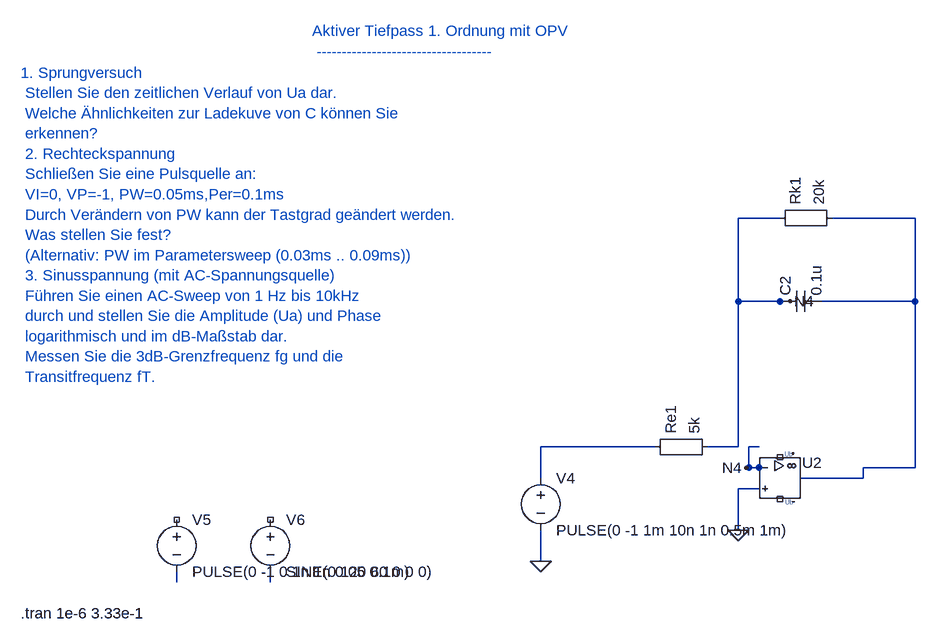
[diagram p0: schematic 7_2_1_Aktiver_Tiefpass.asc]
7_2_1_Aktiver_Tiefpass.asc, the LTspice schematic file:
Version 4
SHEET 1 880 680
WIRE 1296 496 1312 496
WIRE 1200 752 1184 752
WIRE 1184 752 1184 720
WIRE 1184 720 1200 720
WIRE 1264 768 1360 768
WIRE 1360 768 1360 752
WIRE 864 848 864 864
WIRE 304 912 304 928
WIRE 448 912 448 928
WIRE 1232 496 1168 496
WIRE 1168 720 1120 720
WIRE 1200 784 1168 784
WIRE 1168 784 1168 848
WIRE 1360 752 1440 752
WIRE 1440 752 1440 496
WIRE 1168 496 1168 720
WIRE 1232 368 1168 368
WIRE 1168 368 1168 496
WIRE 1440 496 1312 496
WIRE 1312 368 1440 368
WIRE 1440 368 1440 496
WIRE 864 896 864 864
WIRE 864 768 864 720
WIRE 864 720 1040 720
WIRE 1232 496 1248 496
WIRE 1200 752 1180 752
FLAG 1168 848 0
FLAG 864 896 0
FLAG 1168 848 0
FLAG 864 896 0
FLAG 1248 496 N4
FLAG 1180 752 N4
SYMBOL Misc\EuropeanResistor 1024 736 R270
SYMATTR InstName Re1
SYMATTR Value 5k
SYMBOL cap 1232 512 R270
SYMATTR InstName C2
SYMATTR Value 0.1u
SYMBOL UniversalOpAmp2 1232 768 R0
SYMATTR InstName U2
SYMATTR Value UniversalOpAmp2
SYMBOL Misc\EuropeanResistor 1216 384 R270
SYMATTR InstName Rk1
SYMATTR Value 20k
SYMBOL voltage 864 752 R0
SYMATTR InstName V4
SYMATTR Value PULSE(0 -1 1m 10n 1n 0.5m 1m)
SYMBOL voltage 304 816 R0
SYMATTR InstName V5
SYMATTR Value PULSE(0 -1 0 1n 1n 0.05 0.1m)
SYMBOL voltage 448 816 R0
SYMATTR InstName V6
SYMATTR Value SINE(0 120 60 0 0 0)
TEXT 64 976 Left 2 !.tran 1e-6 3.33e-1
TEXT 512 80 Left 2 ;Aktiver Tiefpass 1. Ordnung mit OPV \n -----------------------------------
TEXT 64 144 Left 2 ;1. Sprungversuch \n Stellen Sie den zeitlichen Verlauf von Ua dar. \n Welche Ähnlichkeiten zur Ladekuve von C können Sie \n erkennen? \n 2. Rechteckspannung \n Schließen Sie eine Pulsquelle an: \n VI=0, VP=-1, PW=0.05ms,Per=0.1ms \n Durch Verändern von PW kann der Tastgrad geändert werden. \n Was stellen Sie fest? \n (Alternativ: PW im Parametersweep (0.03ms .. 0.09ms)) \n 3. Sinusspannung (mit AC-Spannungsquelle) \n Führen Sie einen AC-Sweep von 1 Hz bis 10kHz \n durch und stellen Sie die Amplitude (Ua) und Phase \n logarithmisch und im dB-Maßstab dar. \n Messen Sie die 3dB-Grenzfrequenz fg und die \n Transitfrequenz fT.

The netlist it stands for:
* 7_2_1_Aktiver_Tiefpass.asc
Re1 N004 N4 5k
C2 N4 N001 0.1u
XU2 0 N4 NC_01 NC_02 N001 level2 UniversalOpAmp2 Avol=1Meg GBW=10Meg Slew=10Meg Ilimit=25m Rail=0 Vos=0 En=0 Enk=0 In=0 Ink=0 Rin=500Meg  ; pins In+ In- V+ V- OUT
Rk1 N4 N001 20k
V4 N004 0 PULSE(0 -1 1m 10n 1n 0.5m 1m)
V5 NC_03 N002 PULSE(0 -1 0 1n 1n 0.05 0.1m)
V6 NC_04 N003 SINE(0 120 60 0 0 0)
.tran 1e-6 3.33e-1
* Aktiver Tiefpass 1. Ordnung mit OPV
*  -----------------------------------
* 1. Sprungversuch
*  Stellen Sie den zeitlichen Verlauf von Ua dar.
*  Welche Ähnlichkeiten zur Ladekuve von C können Sie
*  erkennen?
*  2. Rechteckspannung
*  Schließen Sie eine Pulsquelle an:
*  VI=0, VP=-1, PW=0.05ms,Per=0.1ms
*  Durch Verändern von PW kann der Tastgrad geändert werden.
*  Was stellen Sie fest?
*  (Alternativ: PW im Parametersweep (0.03ms .. 0.09ms))
*  3. Sinusspannung (mit AC-Spannungsquelle)
*  Führen Sie einen AC-Sweep von 1 Hz bis 10kHz
*  durch und stellen Sie die Amplitude (Ua) und Phase
*  logarithmisch und im dB-Maßstab dar.
*  Messen Sie die 3dB-Grenzfrequenz fg und die
*  Transitfrequenz fT.
.lib UniversalOpAmp2.lib
.backanno
.end